# Altium schematic sheet MotorControl.SchDoc
size A4; SheetNumber: 2; SheetTotal: 3
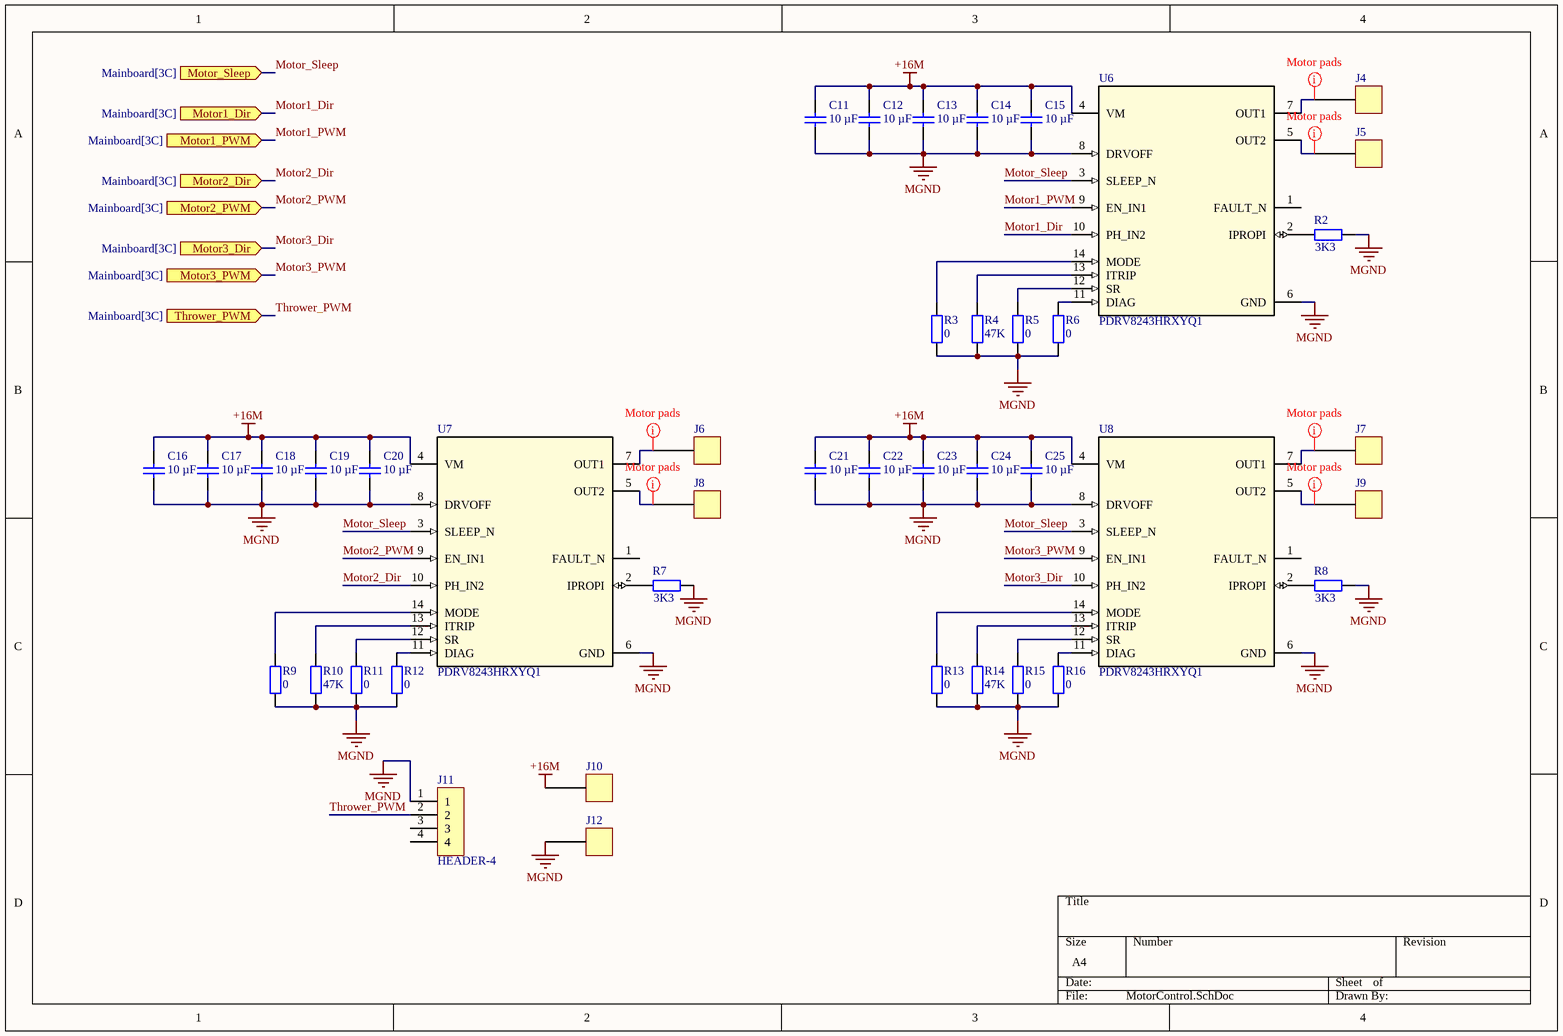
[diagram p0: MotorControl.SchDoc]

## Parts
C11  value 10 µF  [CAP_0805]  (hidden comment: MLCC)
C12  value 10 µF  [CAP_0805]  (hidden comment: MLCC)
C13  value 10 µF  [CAP_0805]  (hidden comment: MLCC)
C14  value 10 µF  [CAP_0805]  (hidden comment: MLCC)
C15  value 10 µF  [CAP_0805]  (hidden comment: MLCC)
C16  value 10 µF  [CAP_0805]  (hidden comment: MLCC)
C17  value 10 µF  [CAP_0805]  (hidden comment: MLCC)
C18  value 10 µF  [CAP_0805]  (hidden comment: MLCC)
C19  value 10 µF  [CAP_0805]  (hidden comment: MLCC)
C20  value 10 µF  [CAP_0805]  (hidden comment: MLCC)
C21  value 10 µF  [CAP_0805]  (hidden comment: MLCC)
C22  value 10 µF  [CAP_0805]  (hidden comment: MLCC)
C23  value 10 µF  [CAP_0805]  (hidden comment: MLCC)
C24  value 10 µF  [CAP_0805]  (hidden comment: MLCC)
C25  value 10 µF  [CAP_0805]  (hidden comment: MLCC)
J4  Generic Power Pad  [New footprint 1]  (value not drawn)
J5  Generic Power Pad  [New footprint 1]  (value not drawn)
J6  Generic Power Pad  [New footprint 1]  (value not drawn)
J7  Generic Power Pad  [New footprint 1]  (value not drawn)
J8  Generic Power Pad  [New footprint 1]  (value not drawn)
J9  Generic Power Pad  [New footprint 1]  (value not drawn)
J10  Generic Power Pad  [New footprint 1]  (value not drawn)
J11  HEADER-4  [MICRO-MATCH-FOB-04]
J12  Generic Power Pad  [New footprint 1]  (value not drawn)
R2  value 3K3  [RC0603N]  (hidden comment: RES)
R3  value 0  [RC0603N]  (hidden comment: RES)
R4  value 47K  [RC0603N]  (hidden comment: RES)
R5  value 0  [RC0603N]  (hidden comment: RES)
R6  value 0  [RC0603N]  (hidden comment: RES)
R7  value 3K3  [RC0603N]  (hidden comment: RES)
R8  value 3K3  [RC0603N]  (hidden comment: RES)
R9  value 0  [RC0603N]  (hidden comment: RES)
R10  value 47K  [RC0603N]  (hidden comment: RES)
R11  value 0  [RC0603N]  (hidden comment: RES)
R12  value 0  [RC0603N]  (hidden comment: RES)
R13  value 0  [RC0603N]  (hidden comment: RES)
R14  value 47K  [RC0603N]  (hidden comment: RES)
R15  value 0  [RC0603N]  (hidden comment: RES)
R16  value 0  [RC0603N]  (hidden comment: RES)
U6  PDRV8243HRXYQ1  [RXY0014A-MFG]
U7  PDRV8243HRXYQ1  [RXY0014A-MFG]
U8  PDRV8243HRXYQ1  [RXY0014A-MFG]

## Ports
Motor1_Dir (in, see Mainboard[3C]), Motor1_PWM (in, see Mainboard[3C]), Motor2_Dir (in, see Mainboard[3C]), Motor2_PWM (in, see Mainboard[3C]), Motor3_Dir (in, see Mainboard[3C]), Motor3_PWM (in, see Mainboard[3C]), Motor_Sleep (in, see Mainboard[3C]), Thrower_PWM (in, see Mainboard[3C])

## Nets
+16M: C11.2 C12.2 C13.2 C14.2 C15.2 C16.2 C17.2 C18.2 C19.2 C20.2 C21.2 C22.2 C23.2 C24.2 C25.2 J10.1 U6.4(VM) U7.4(VM) U8.4(VM)
MGND: C11.1 C12.1 C13.1 C14.1 C15.1 C16.1 C17.1 C18.1 C19.1 C20.1 C21.1 C22.1 C23.1 C24.1 C25.1 J11.1 J12.1 R2.2 R3.1 R4.1 R5.1 R6.1 R7.2 R8.2 R9.1 R10.1 R11.1 R12.1 R13.1 R14.1 R15.1 R16.1 U6.6(GND) U6.8(DRVOFF) U7.6(GND) U7.8(DRVOFF) U8.6(GND) U8.8(DRVOFF)
Motor1_Dir: U6.10(PH_IN2) ; port Motor1_Dir
Motor1_PWM: U6.9(EN_IN1) ; port Motor1_PWM
Motor2_Dir: U7.10(PH_IN2) ; port Motor2_Dir
Motor2_PWM: U7.9(EN_IN1) ; port Motor2_PWM
Motor3_Dir: U8.10(PH_IN2) ; port Motor3_Dir
Motor3_PWM: U8.9(EN_IN1) ; port Motor3_PWM
Motor_Sleep: U6.3(SLEEP_N) U7.3(SLEEP_N) U8.3(SLEEP_N) ; port Motor_Sleep
Thrower_PWM: J11.2 ; port Thrower_PWM
NetJ4_1: J4.1 U6.7(OUT1)
NetJ5_1: J5.1 U6.5(OUT2)
NetJ6_1: J6.1 U7.7(OUT1)
NetJ7_1: J7.1 U8.7(OUT1)
NetJ8_1: J8.1 U7.5(OUT2)
NetJ9_1: J9.1 U8.5(OUT2)
NetR2_1: R2.1 U6.2(IPROPI)
NetR3_2: R3.2 U6.14(MODE)
NetR4_2: R4.2 U6.13(ITRIP)
NetR5_2: R5.2 U6.12(SR)
NetR6_2: R6.2 U6.11(DIAG)
NetR7_1: R7.1 U7.2(IPROPI)
NetR8_1: R8.1 U8.2(IPROPI)
NetR9_2: R9.2 U7.14(MODE)
NetR10_2: R10.2 U7.13(ITRIP)
NetR11_2: R11.2 U7.12(SR)
NetR12_2: R12.2 U7.11(DIAG)
NetR13_2: R13.2 U8.14(MODE)
NetR14_2: R14.2 U8.13(ITRIP)
NetR15_2: R15.2 U8.12(SR)
NetR16_2: R16.2 U8.11(DIAG)

Not connected (* = marked no-connect by the designer): J11 3 4; U6 1(FAULT_N); U7 1(FAULT_N); U8 1(FAULT_N)

## Layout directives
net class Motor pads: NetJ4_1, NetJ5_1, NetJ6_1, NetJ7_1, NetJ8_1, NetJ9_1

## Library data of the parts
C11-C25 = CMP-059-000002-1: Multilayer Ceramic Capacitors; Tolerance: 10%; VoltageRatingDC: 5V; Component Type: Standard; Design Item ID: MLCC; Pin Count: 2; Source: Capacitors.SchLib
J4-J10 J12 = CMP-00002-4
J11 = CMP-051-000006-1: Design Item ID: HEADER-4; Component Type: Standard; Source: connectors_micromatch.SchLib; Pin Count: 4
R2-R16 = CMP-061-000001-5: Chip Resistors; PowerRating: 0.25W; Component Type: Standard; Source: Resistors.SchLib; Pin Count: 2; Design Item ID: RES
U6-U8 = CMP-030-000000-4: No Description Available; Mfr_Name: Texas Instruments; Component Type: Standard; RefDes: RefDes; Design Item ID: PDRV8243HRXYQ1; Pin Count: 14; Copyright: Copyright (C) 2022 Ultra Librarian. All rights reserved.; Manufacturer_Part_Number: PDRV8243HRXYQ1; Type: DEV; Source: PDRV8243HRXYQ1.SchLib